# EAGLE design 4x4_hirose (EAGLE 7.2.0)
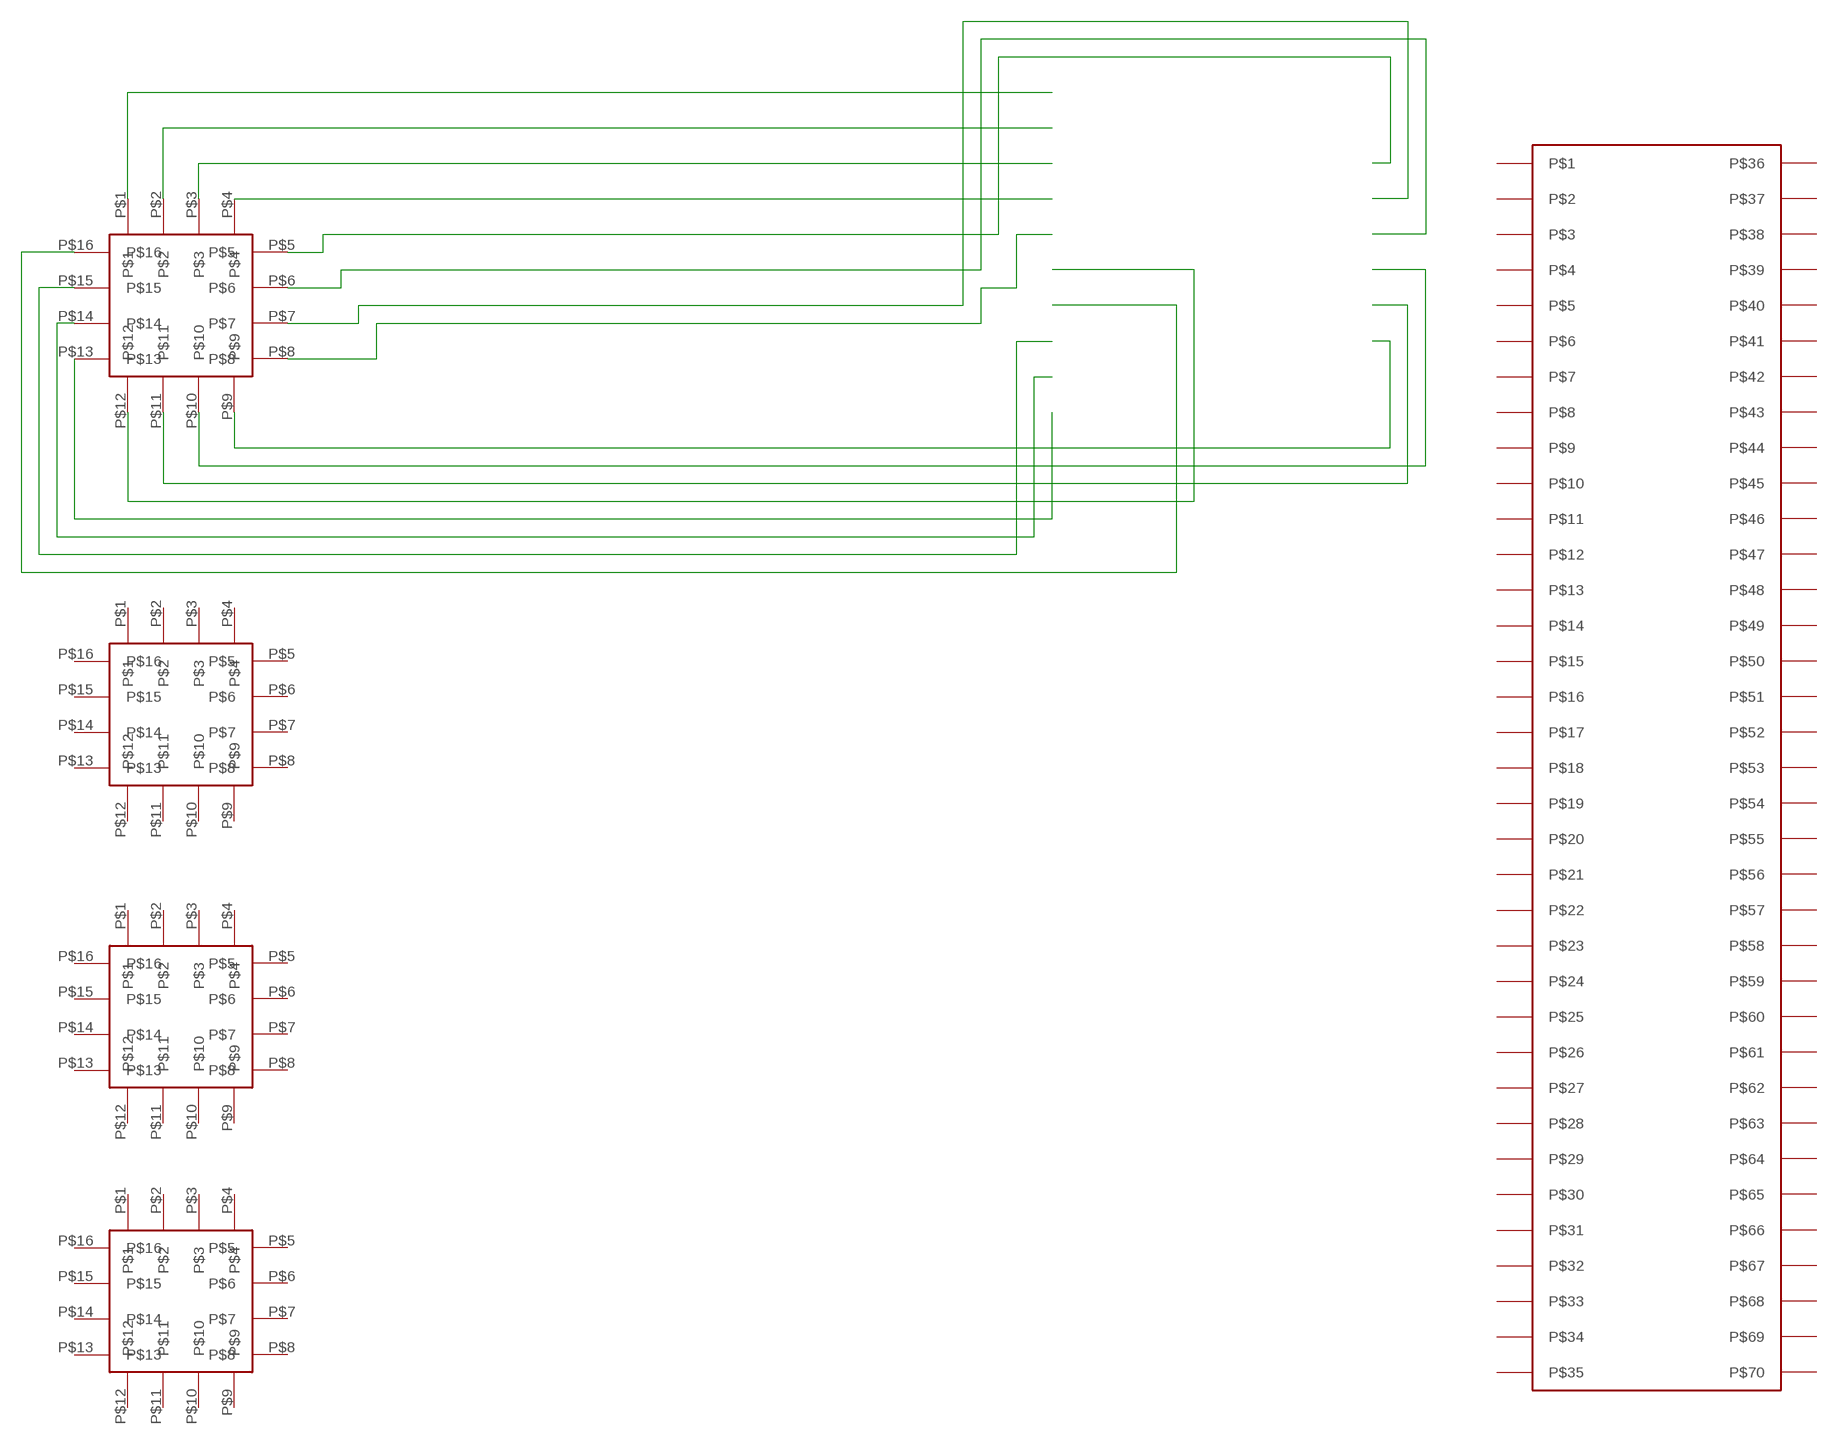
[diagram p0: schematic, sheet 1]

## Parts
U$1  GG_4X4_ARRAY  [GG_4X4_ARRAY]
U$2  HIROSE_DF40_70PIN  [HIROSE_DF40C-70DS]
U$3  GG_4X4_ARRAY  [GG_4X4_ARRAY]
U$4  GG_4X4_ARRAY  [GG_4X4_ARRAY]
U$5  GG_4X4_ARRAY  [GG_4X4_ARRAY]

## Nets
N$20: U$1.P$1
N$30: U$1.P$2
N$40: U$1.P$3
N$50: U$1.P$4
N$60: U$1.P$5
N$70: U$1.P$6
N$80: U$1.P$7
N$90: U$1.P$8
N$100: U$1.P$9
N$110: U$1.P$10
N$120: U$1.P$11
N$130: U$1.P$12
N$140: U$1.P$13
N$150: U$1.P$14
N$160: U$1.P$15
N$170: U$1.P$16
Unconnected: U$2.P$1 U$2.P$2 U$2.P$3 U$2.P$4 U$2.P$5 U$2.P$6 U$2.P$7 U$2.P$8 U$2.P$9 U$2.P$10 U$2.P$11 U$2.P$12 U$2.P$13 U$2.P$14 U$2.P$15 U$2.P$16 U$2.P$17 U$2.P$18 U$2.P$19 U$2.P$20 U$2.P$21 U$2.P$22 U$2.P$23 U$2.P$24 U$2.P$25 U$2.P$26 U$2.P$27 U$2.P$28 U$2.P$29 U$2.P$30 U$2.P$31 U$2.P$32 U$2.P$33 U$2.P$34 U$2.P$35 U$2.P$36 U$2.P$37 U$2.P$38 U$2.P$39 U$2.P$40 U$2.P$41 U$2.P$42 U$2.P$43 U$2.P$44 U$2.P$45 U$2.P$46 U$2.P$47 U$2.P$48 U$2.P$49 U$2.P$50 U$2.P$51 U$2.P$52 U$2.P$53 U$2.P$54 U$2.P$55 U$2.P$56 U$2.P$57 U$2.P$58 U$2.P$59 U$2.P$60 U$2.P$61 U$2.P$62 U$2.P$63 U$2.P$64 U$2.P$65 U$2.P$66 U$2.P$67 U$2.P$68 U$2.P$69 U$2.P$70 U$3.P$1 U$3.P$2 U$3.P$3 U$3.P$4 U$3.P$5 U$3.P$6 U$3.P$7 U$3.P$8 U$3.P$9 U$3.P$10 U$3.P$11 U$3.P$12 U$3.P$13 U$3.P$14 U$3.P$15 U$3.P$16 U$4.P$1 U$4.P$2 U$4.P$3 U$4.P$4 U$4.P$5 U$4.P$6 U$4.P$7 U$4.P$8 U$4.P$9 U$4.P$10 U$4.P$11 U$4.P$12 U$4.P$13 U$4.P$14 U$4.P$15 U$4.P$16 U$5.P$1 U$5.P$2 U$5.P$3 U$5.P$4 U$5.P$5 U$5.P$6 U$5.P$7 U$5.P$8 U$5.P$9 U$5.P$10 U$5.P$11 U$5.P$12 U$5.P$13 U$5.P$14 U$5.P$15 U$5.P$16

## Library data of the parts
U$1 U$3-U$5 = GG_4x4_3mildrill_20milspacing:GG_4X4_ARRAY
U$2 = GG_hirose70:HIROSE_DF40_70PIN

## Board
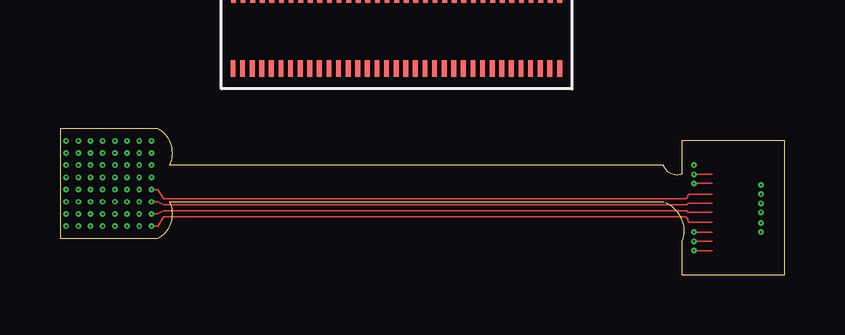
[diagram p1: board, top side]
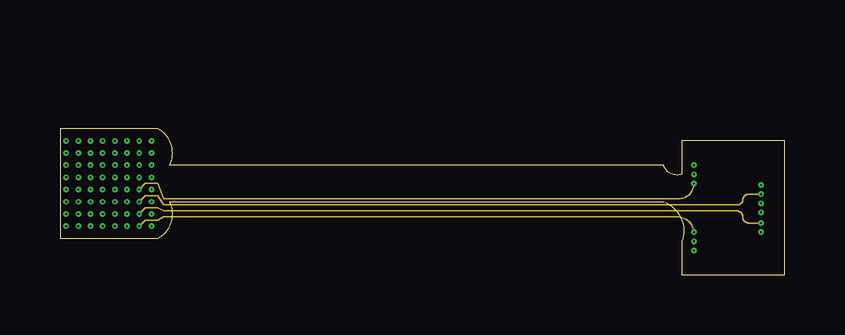
[diagram p2: board, inner layer Route2]
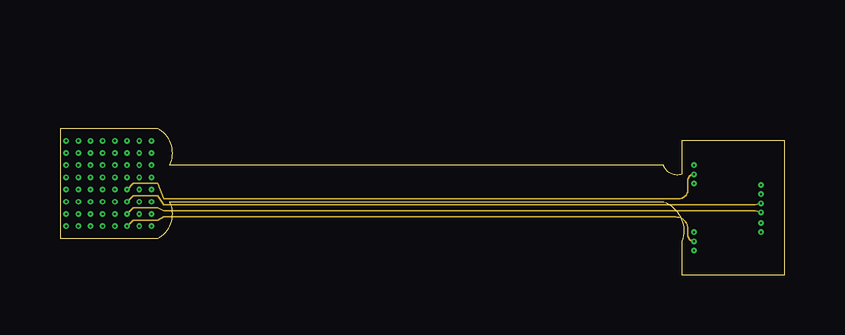
[diagram p3: board, inner layer Route15]
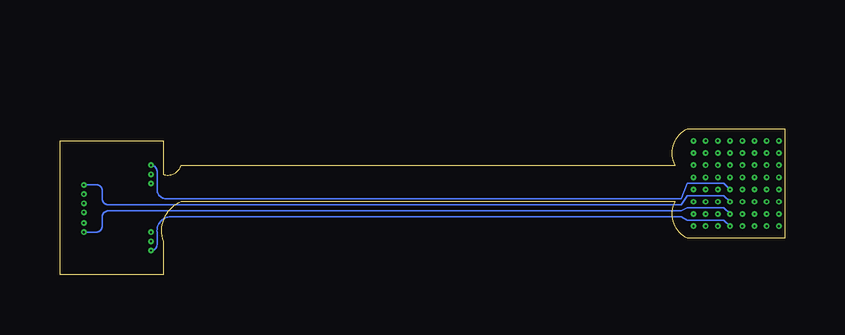
[diagram p4: board, bottom side, seen from below]

Size 30.21 x 6.1 mm. Coordinates in mm from the lower left corner, seen from the top.
Outline: 0,1.52 4.06,1.52 arc90 4.57,3.05 25.15,3.05 arc-90 25.91,1.4 25.91,0 30.21,0 30.21,5.59 25.91,5.59 25.91,4.19 arc-90 25.15,4.57 4.57,4.57 arc90 4.06,6.1 0,6.1 0,1.52
Copper layers (1*2*15*16): Top 0.035mm / dielectric 1.5mm / Route2 0.035mm / dielectric 0.15mm / Route15 0.035mm / dielectric 0.2mm / Bottom 0.035mm
Design rules "default *": minimum track width 3mil, minimum drill 0.1mm, track to track 0.15mm, track to pad 0.15mm, pad to pad 0.15mm, via to via 0.15mm, smd to smd 0.15mm, copper to edge 40mil, drill to drill 0.15mm, minimum pad ring 3mil, minimum via ring 3mil, stop-mask expansion 4mil, vias tented up to drill 0mil, thermal gap 10mil

### Footprints (pad centres in the part's own frame; a part is rotated, then mirrored left to right if it is on the bottom)
GG_4X4_ARRAY = drill 0.076 pad 0.178: P$1 0,0; P$2 0.508,0; P$3 1.016,0; P$4 1.524,0; P$5 0,-0.508; P$6 0.508,-0.508; P$7 1.016,-0.508; P$8 1.524,-0.508; P$9 0,-1.016; P$10 0.508,-1.016; P$11 1.016,-1.016; P$12 1.524,-1.016; P$13 0,-1.524; P$14 0.508,-1.524; P$15 1.016,-1.524; P$16 1.524,-1.524
HIROSE_DF40C-70DS = smd 0.2 x 0.7: P$1 0,0; P$2 -0.4,0; P$3 -0.8,0; P$4 -1.2,0; P$5 -1.6,0; P$6 -2,0; P$7 -2.4,0; P$8 -2.8,0; P$9 -3.2,0; P$10 -3.6,0; P$11 -4,0; P$12 -4.4,0; P$13 -4.8,0; P$14 -5.2,0; P$15 -5.6,0; P$16 -6,0; P$17 -6.4,0; P$18 -6.8,0; P$19 -7.2,0; P$20 -7.6,0; P$21 -8,0; P$22 -8.4,0; P$23 -8.8,0; P$24 -9.2,0; P$25 -9.6,0; P$26 -10,0; P$27 -10.4,0; P$28 -10.8,0; P$29 -11.2,0; P$30 -11.6,0; P$31 -12,0; P$32 -12.4,0; P$33 -12.8,0; P$34 -13.2,0; P$35 -13.6,0; P$36 0,-3.08; P$37 -0.42,-3.08; P$38 -0.82,-3.08; P$39 -1.22,-3.08; P$40 -1.62,-3.08; P$41 -2.02,-3.08; P$42 -2.42,-3.08; P$43 -2.82,-3.08; P$44 -3.22,-3.08; P$45 -3.62,-3.08; P$46 -4.02,-3.08; P$47 -4.42,-3.08; P$48 -4.82,-3.08; P$49 -5.22,-3.08; P$50 -5.62,-3.08; P$51 -6.02,-3.08; P$52 -6.42,-3.08; P$53 -6.82,-3.08; P$54 -7.22,-3.08; P$55 -7.62,-3.08; P$56 -8.02,-3.08; P$57 -8.42,-3.08; P$58 -8.82,-3.08; P$59 -9.22,-3.08; P$60 -9.62,-3.08; P$61 -10.02,-3.08; P$62 -10.42,-3.08; P$63 -10.82,-3.08; P$64 -11.22,-3.08; P$65 -11.62,-3.08; P$66 -12.02,-3.08; P$67 -12.42,-3.08; P$68 -12.82,-3.08; P$69 -13.22,-3.08; P$70 -13.62,-3.08

### Placement (x,y rotation side)
U$1  2.29,3.56 0 top
U$2  20.83,11.68 0 top
U$3  2.29,5.59 0 top
U$4  0.25,3.56 0 top
U$5  0.25,5.59 0 top

### Tracks (layer width: path | path; a pad name or v marks a point on that pad's centre or on a via)
N$20  (via drill 0.08)
  Bottom 0.07: U$1.P$1 2.54,3.81 4.06,3.81 4.32,3.17 25.78,3.17 arc90 26.16,3.56 26.16,4.32 arc-90 v26.42,4.57
N$30  (via drill 0.08)
  Top 0.07: v26.42,4.19 27.18,4.19
  Route15 0.07: U$1.P$2 3.05,3.81 4.06,3.81 4.32,3.17 25.78,3.17 arc90 26.16,3.56 26.16,3.94 arc-90 v26.42,4.19
N$40  (via drill 0.08)
  Top 0.07: v26.42,3.81 27.18,3.81
  Route2 0.07: U$1.P$3 3.56,3.81 4.06,3.81 4.32,3.17 25.78,3.17 arc90 v26.42,3.81
N$50
  Top 0.07: U$1.P$4 4.06,3.56 4.32,3.17 26.04,3.17 arc90 26.16,3.3 arc-90 26.26,3.37 27.18,3.37
N$60  (via drill 0.08)
  Top 0.07: v29.21,3.75
  Bottom 0.07: U$1.P$5 2.54,3.3 4.06,3.3 4.32,2.92 28.19,2.92 arc90 28.45,3.17 28.45,3.56 arc-90 28.7,3.75 v29.21,3.75
N$70  (via drill 0.08)
  Top 0.07: 29.21,2.95 v29.21,2.98
  Route15 0.07: U$1.P$6 3.05,3.3 4.06,3.3 4.32,2.92 28.7,2.92 arc28 v29.21,2.98
N$80  (via drill 0.08)
  Top 0.07: 29.21,3.35 v29.21,3.37
  Route2 0.07: U$1.P$7 3.56,3.3 4.06,3.3 4.32,2.92 28.19,2.92 arc90 28.45,3.11 arc-90 28.7,3.37 v29.21,3.37
N$90
  Top 0.07: U$1.P$8 4.06,3.05 4.32,2.92 26.1,2.92 arc90 26.16,2.98 27.18,2.98
N$100  (via drill 0.08)
  Bottom 0.07: U$1.P$9 2.54,2.79 4.06,2.79 4.32,2.67 28.19,2.67 arc-90 28.45,2.41 28.45,2.03 arc90 28.7,1.78 v29.21,1.78
N$110  (via drill 0.08)
  Route15 0.07: U$1.P$10 3.05,2.79 4.06,2.79 4.32,2.67 28.7,2.67 arc-28 v29.21,2.6
N$120  (via drill 0.08)
  Route2 0.07: U$1.P$11 3.56,2.79 4.06,2.79 4.32,2.67 28.19,2.67 arc-90 28.45,2.41 arc90 28.7,2.16 v29.21,2.16
N$130
  Top 0.07: U$1.P$12 4.06,2.54 4.32,2.67 26.1,2.67 arc-90 26.16,2.6 27.18,2.6
N$140  (via drill 0.08)
  Top 0.07: v26.42,1.02 27.18,1.02
  Bottom 0.07: U$1.P$13 2.54,2.29 4.06,2.29 4.32,2.41 25.65,2.41 arc-90 26.16,1.78 26.16,1.27 arc90 v26.42,1.02
N$150  (via drill 0.08)
  Top 0.07: v26.42,1.4 27.18,1.4
  Route15 0.07: U$1.P$14 3.05,2.29 4.06,2.29 4.32,2.41 25.65,2.41 arc-90 26.16,1.91 26.16,1.65 arc90 v26.42,1.4
N$160  (via drill 0.08)
  Top 0.07: v26.42,1.78 27.18,1.78
  Route2 0.07: U$1.P$15 3.56,2.29 4.06,2.29 4.32,2.41 25.65,2.41 arc-90 v26.42,1.78
N$170
  Top 0.07: U$1.P$16 4.06,2.03 4.32,2.41 26.04,2.41 arc-90 26.16,2.29 arc90 26.26,2.18 27.18,2.18